# EAGLE design Arduino Mega Extended Breakout Shield (EAGLE 6.2)
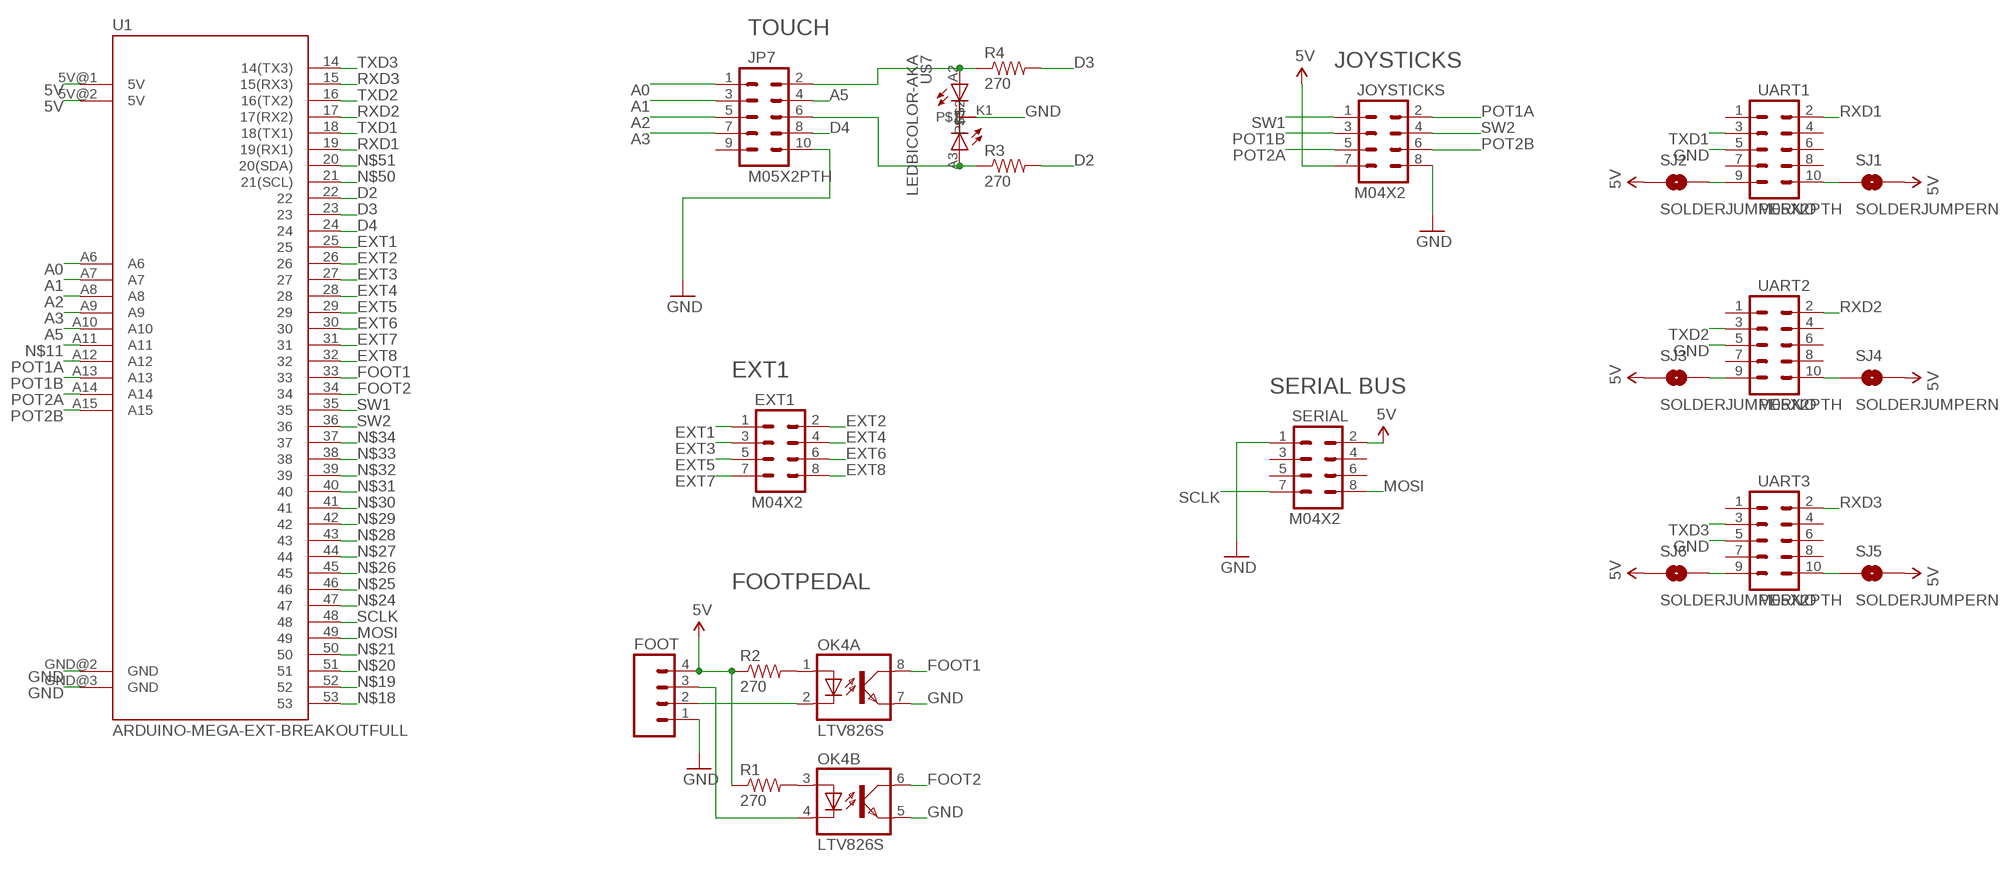
[diagram p0: schematic, sheet 1]

## Parts
EXT1  M04X2  [2X4]
FOOT  M04LOCK  [1X04_LOCK]
JOYSTICKS  M04X2  [2X4]
JP7  M05X2PTH  [AVR_ICSP]
OK4  LTV826S  [DIL8-SMD]
R1  270  RESISTOR0603-RES  [0603-RES]
R2  270  RESISTOR0603-RES  [0603-RES]
R3  270  RESISTOR0603-RES  [0603-RES]
R4  270  RESISTOR0603-RES  [0603-RES]
SERIAL  M04X2  [2X4]
SJ1  SOLDERJUMPERNO  [SJ_2S-NO]
SJ2  SOLDERJUMPERNO  [SJ_2S-NO]
SJ3  SOLDERJUMPERNO  [SJ_2S-NO]
SJ4  SOLDERJUMPERNO  [SJ_2S-NO]
SJ5  SOLDERJUMPERNO  [SJ_2S-NO]
SJ6  SOLDERJUMPERNO  [SJ_2S-NO]
U1  ARDUINO-MEGA-EXT-BREAKOUTFULL  [ARDUINO_MEGA_EXT_BREAKOUT]
U$7  LEDBICOLOR-AKA  [LED5MM-BICOLOR]
UART1  M05X2PTH  [AVR_ICSP]
UART2  M05X2PTH  [AVR_ICSP]
UART3  M05X2PTH  [AVR_ICSP]

## Nets
5V [Power]: FOOT.4 JOYSTICKS.7 R1.1 R2.1 SERIAL.2 SJ1.2 SJ2.1 SJ3.1 SJ4.2 SJ5.2 SJ6.1 U1.5V@1(5V) U1.5V@2(5V)
A0: JP7.1 U1.A6
A1: JP7.3 U1.A7
A2: JP7.5 U1.A8
A3: JP7.7 U1.A9
A5: JP7.4 U1.A10
D2: R3.2 U1.22
D3: R4.2 U1.23
D4: JP7.8 U1.24
EXT1: EXT1.1 U1.25
EXT2: EXT1.2 U1.26
EXT3: EXT1.3 U1.27
EXT4: EXT1.4 U1.28
EXT5: EXT1.5 U1.29
EXT6: EXT1.6 U1.30
EXT7: EXT1.7 U1.31
EXT8: EXT1.8 U1.32
FOOT1: OK4.8(A:COL) U1.33
FOOT2: OK4.6(B:COL) U1.34
GND [Power]: FOOT.1 JOYSTICKS.8 JP7.10 OK4.5(B:EMIT) OK4.7(A:EMIT) SERIAL.1 U1.GND@2(GND) U1.GND@3(GND) U$7.K1 UART1.5 UART2.5 UART3.5
MOSI: SERIAL.8 U1.49
N$1: OK4.3(B:A) R1.2
N$2: OK4.1(A:A) R2.2
N$3: SJ6.2 UART3.9
N$4: FOOT.2 OK4.2(A:C)
N$5: FOOT.3 OK4.4(B:C)
N$6: SJ3.2 UART2.9
N$7: JP7.2 R4.1 U$7.A2
N$8: JP7.6 R3.1 U$7.A3
N$9: SJ2.2 UART1.9
N$10: SJ1.1 UART1.10
N$11: U1.A11
N$12: SJ4.1 UART2.10
N$13: SJ5.1 UART3.10
N$18: U1.53
N$19: U1.52
N$20: U1.51
N$21: U1.50
N$24: U1.47
N$25: U1.46
N$26: U1.45
N$27: U1.44
N$28: U1.43
N$29: U1.42
N$30: U1.41
N$31: U1.40
N$32: U1.39
N$33: U1.38
N$34: U1.37
N$50: U1.21(21(SCL))
N$51: U1.20(20(SDA))
POT1A: JOYSTICKS.2 U1.A12
POT1B: JOYSTICKS.3 U1.A13
POT2A: JOYSTICKS.5 U1.A14
POT2B: JOYSTICKS.6 U1.A15
RXD1: U1.19(19(RX1)) UART1.2
RXD2: U1.17(17(RX2)) UART2.2
RXD3: U1.15(15(RX3)) UART3.2
SCLK: SERIAL.7 U1.48
SW1: JOYSTICKS.1 U1.35
SW2: JOYSTICKS.4 U1.36
TXD1: U1.18(18(TX1)) UART1.3
TXD2: U1.16(16(TX2)) UART2.3
TXD3: U1.14(14(TX3)) UART3.3
Unconnected: JP7.9 SERIAL.3 SERIAL.4 SERIAL.5 SERIAL.6 UART1.1 UART1.4 UART1.6 UART1.7 UART1.8 UART2.1 UART2.4 UART2.6 UART2.7 UART2.8 UART3.1 UART3.4 UART3.6 UART3.7 UART3.8

## Notes on the sheet
- TOUCH
- JOYSTICKS
- EXT1
- SERIAL BUS
- FOOTPEDAL

## Library data of the parts
EXT1 JOYSTICKS SERIAL = SparkFun:M04X2
FOOT = SparkFun:M04: Header 4 Standard 4-pin 0.1" header. Use with straight break away headers (SKU : PRT-00116), right angle break away headers (PRT-00553), swiss pins (PRT-00743), machine pins (PRT-00117), and female headers (PRT-00115). Molex polarized connector foot print use with SKU : PRT-08231 with associated crimp pins and housings. 1MM SMD Version SKU: PRT-10208
JP7 UART1-UART3 = SparkFun:M05X2: Header 5x2 Standard 10-pin dual row 0.1" header. Commonly used with AVR-ISP. Use with Spark Fun Electronics SKU: PRT-00778
OK4 = optocoupler:LTV826: OPTO COUPLER Source: LITEON, LTV816.pdf; OC_FARNELL: unknown; OC_NEWARK: unknown
R1-R4 = SparkFun:RESISTOR: Resistor Basic schematic elements and footprints for 0603, 1206, and PTH resistors.
SJ1-SJ6 = SparkFun:SOLDERJUMPER: Solder Jumper Standard SMD solder jumper. Used to automate production. Two varients : Normally Open and Normally Closed are the same, but have different paste layers. NC will have a large amount of paste and should jumper during reflow.
U1 = SKAARHOJ:ARDUINO-MEGA-EXT-BREAKOUT: Arduino Mega footprint connections
U$7 = SKAARHOJ:LEDBICOLOR-AKA

## Net classes
0 default: width 0.152 mm, drill 0.406 mm, clearance 0.152 mm
1 Power: width 0.406 mm, drill 0.61 mm, clearance 0.254 mm
3 INput lines: clearance 0.203 mm

## Board
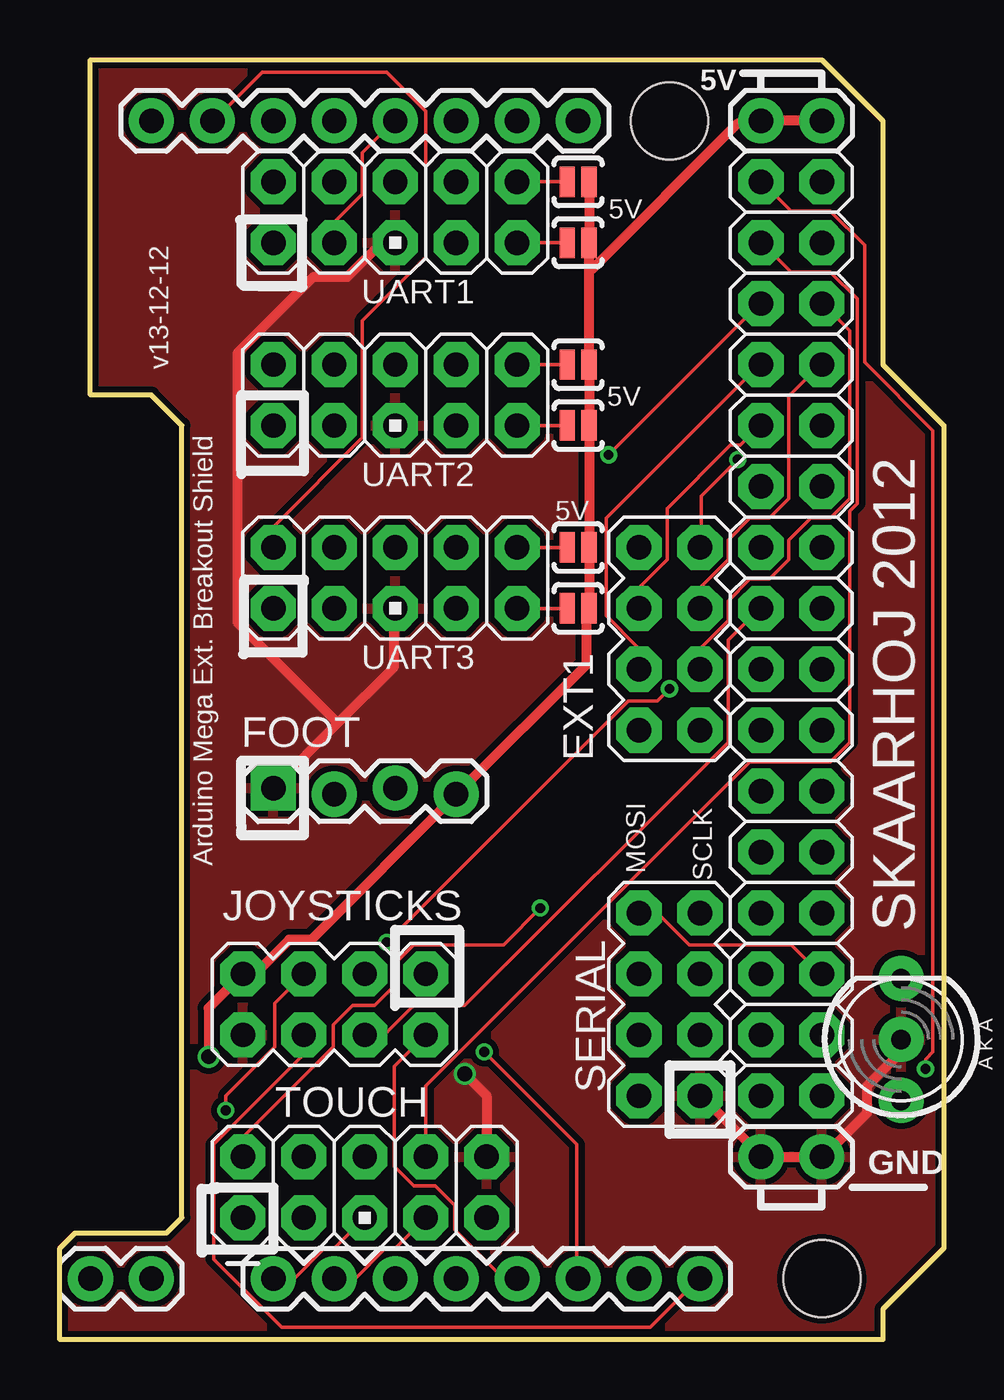
[diagram p1: board, top side]
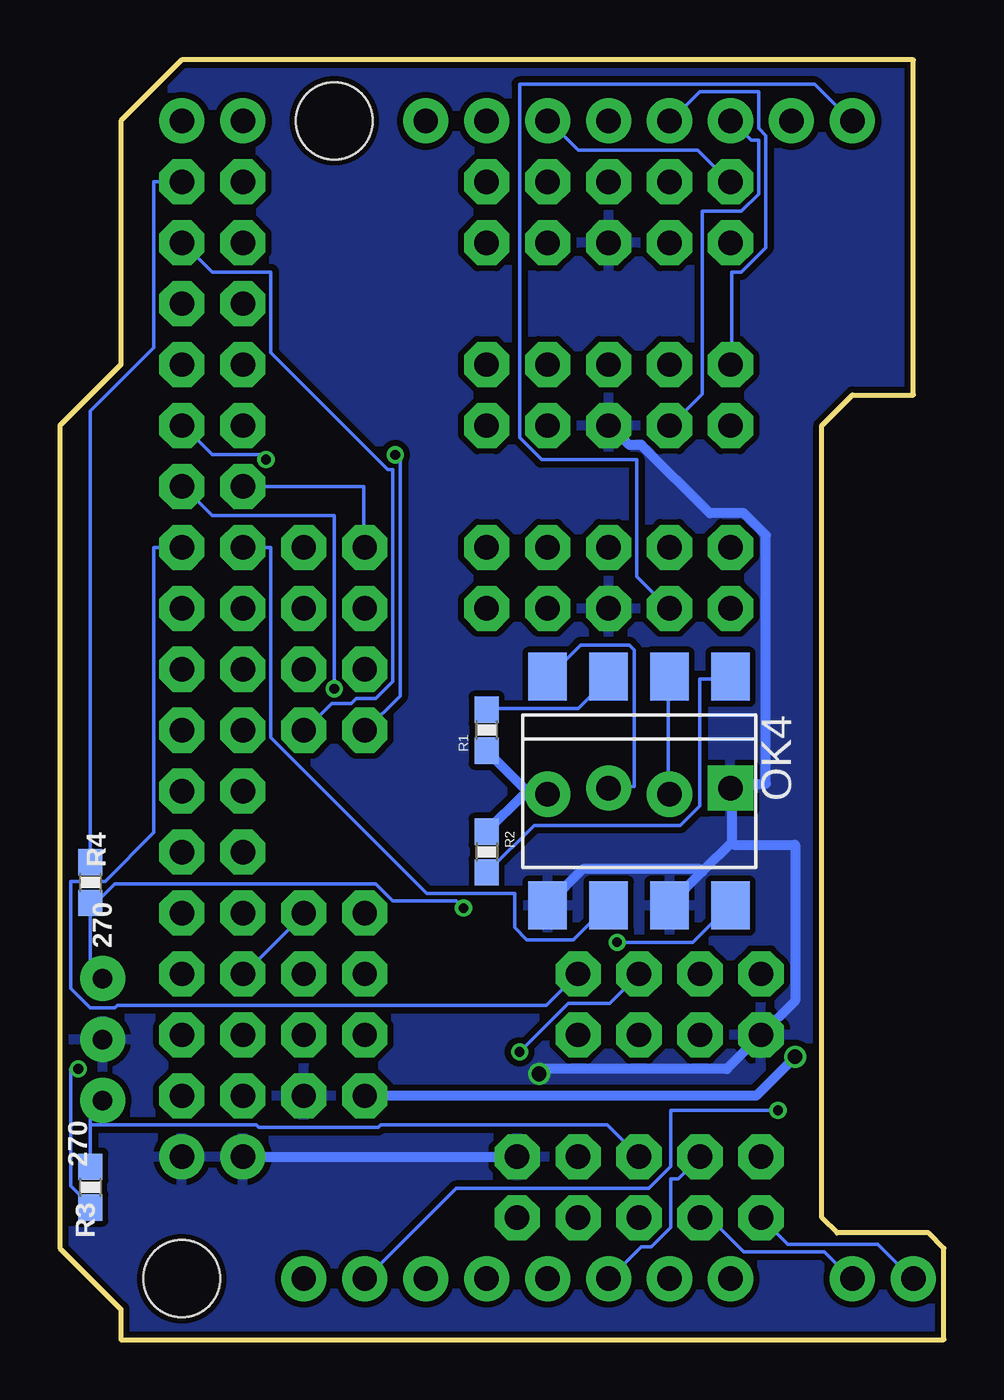
[diagram p2: board, bottom side, seen from below]

Size 36.83 x 53.34 mm. Coordinates in mm from the lower left corner, seen from the top.
Copper layers (1*16): Top 0.035mm / dielectric 1.5mm / Bottom 0.035mm
Design rules: minimum track width 6mil, minimum drill 12mil, track to track 6mil, track to pad 6mil, pad to pad 6mil, via to via 6mil, smd to smd 0mil, copper to edge 10mil, drill to drill 10mil, minimum pad ring 10mil, minimum via ring 6mil, stop-mask expansion 2mil, vias tented up to drill 100mil, thermal gap 10mil

### Footprints (pad centres in the part's own frame; a part is rotated, then mirrored left to right if it is on the bottom)
2X4 = drill 1.016 pad 1.88 octagon: 1 -3.81,-1.27; 2 -3.81,1.27; 3 -1.27,-1.27; 4 -1.27,1.27; 5 1.27,-1.27; 6 1.27,1.27; 7 3.81,-1.27; 8 3.81,1.27
1X04_LOCK = drill 1.016 pad 1.88 square: 1 0,0.127 | drill 1.016 pad 1.88: 2 2.54,-0.127; 3 5.08,0.127; 4 7.62,-0.127
AVR_ICSP = drill 1.016 pad 1.88 octagon: 1 -1.27,5.08; 2 1.27,5.08; 3 -1.27,2.54; 4 1.27,2.54; 5 -1.27,0; 6 1.27,0; 7 -1.27,-2.54; 8 1.27,-2.54; 9 -1.27,-5.08; 10 1.27,-5.08
DIL8-SMD = smd 1.6 x 2: 1 -3.81,-4.77; 2 -1.27,-4.77; 3 1.27,-4.77; 4 3.81,-4.77; 5 3.81,4.77; 6 1.27,4.77; 7 -1.27,4.77; 8 -3.81,4.77
0603-RES = smd 1.1 x 1: 1 -0.85,0; 2 0.85,0
SJ_2S-NO = smd 0.635 x 1.27: 1 -0.45,0; 2 0.45,0
ARDUINO_MEGA_EXT_BREAKOUT = drill 1.016 pad 1.88: 5V@1 29.21,50.8; 5V@2 31.75,50.8; 14 3.81,50.8; 15 6.35,50.8; 16 8.89,50.8; 17 11.43,50.8; 18 13.97,50.8; 19 16.51,50.8; 20 19.05,50.8; 21 21.59,50.8; A6 1.27,2.54; A7 3.81,2.54; A8 8.89,2.54; A9 11.43,2.54; A10 13.97,2.54; A11 16.51,2.54; A12 19.05,2.54; A13 21.59,2.54; A14 24.13,2.54; A15 26.67,2.54; GND@2 29.21,7.62; GND@3 31.75,7.62 | drill 1.016 pad 1.88 octagon: 22 29.21,48.26; 23 31.75,48.26; 24 29.21,45.72; 25 31.75,45.72; 26 29.21,43.18; 27 31.75,43.18; 28 29.21,40.64; 29 31.75,40.64; 30 29.21,38.1; 31 31.75,38.1; 32 29.21,35.56; 33 31.75,35.56; 34 29.21,33.02; 35 31.75,33.02; 36 29.21,30.48; 37 31.75,30.48; 38 29.21,27.94; 39 31.75,27.94; 40 29.21,25.4; 41 31.75,25.4; 42 29.21,22.86; 43 31.75,22.86; 44 29.21,20.32; 45 31.75,20.32; 46 29.21,17.78; 47 31.75,17.78; 48 29.21,15.24; 49 31.75,15.24; 50 29.21,12.7; 51 31.75,12.7; 52 29.21,10.16; 53 31.75,10.16 | hole 3.2: 25.4,50.8; 31.75,2.54
LED5MM-BICOLOR = drill 0.813 pad 1.88: A2 2.54,0; A3 -2.54,0; K1 0,0

### Placement (x,y rotation side)
EXT1  25.4,29.21 90 top
FOOT  8.89,22.86 0 top
JOYSTICKS  11.43,13.97 180 top
JP7  12.7,6.35 90 top
OK4  12.7,22.86 180 bottom
R1  19.05,25.4 90 bottom
R2  19.05,20.32 270 bottom
R3  35.56,6.35 270 bottom
R4  35.56,19.05 90 bottom
SERIAL  25.4,13.97 90 top
SJ1  21.59,48.26 0 top
SJ2  21.59,45.72 180 top
SJ3  21.59,38.1 180 top
SJ4  21.59,40.64 0 top
SJ5  21.59,33.02 0 top
SJ6  21.59,30.48 180 top
U1  0,0 0 top
U$7  35.05,12.51 90 top
UART1  13.97,46.99 90 top
UART2  13.97,39.37 90 top
UART3  13.97,31.75 90 top

### Tracks (layer width: path | path; a pad name or v marks a point on that pad's centre or on a via)
5V  (via drill 0.61)
  Top 0.406: U1.5V@2 U1.5V@1 29.06,50.7 28.25,50.7 22.15,44.6 22.05,44.6 | SJ1.2 SJ2.1 22.05,45.62 22.05,44.6 | 22.05,44.6 22.05,40.74 SJ4.2 SJ3.1 22.05,38 22.05,33.12 SJ5.2 SJ6.1 21.95,30.38 21.95,28.14 16.66,22.86 FOOT.4 16.46,22.66 10.46,16.66 9.55,16.66 8.13,15.24 JOYSTICKS.7 6.2,13.82 v6.2,11.79
  Bottom 0.406: R2.1 19,21.23 17.58,22.66 16.56,22.66 FOOT.4 17.27,22.76 19,24.49 R1.1 | SERIAL.2 7.82,10.16 v6.2,11.79
A0
  Bottom 0.152: JP7.1 6.5,3.96 2.74,3.96 1.32,2.54 U1.A6
A1
  Bottom 0.152: JP7.3 9.75,5.08 8.33,3.66 4.98,3.66 3.86,2.54 U1.A7
A2
  Top 0.152: U1.A8 9.75,2.54 10.97,3.76 11.38,3.76 JP7.5
A3
  Top 0.152: U1.A9 12.29,2.54 13.51,3.76 13.92,3.76 JP7.7
A5
  Bottom 0.152: JP7.4 11.07,6.71 11.38,6.71 11.38,4.67 12.19,3.86 12.6,3.86 13.92,2.54 U1.A10
D2  (via drill 0.41)
  Top 0.152: v36.07,11.28 36.07,11.68 36.37,11.99 36.37,37.9 33.53,40.74 33.53,45.62 32.11,47.04 30.48,47.04 29.26,48.26 U1.22
  Bottom 0.152: v36.07,11.28 36.37,11.28 36.37,6.4 35.56,5.59 R3.2
D3
  Bottom 0.152: R4.2 35.56,38.71 32.92,41.35 32.92,48.26 U1.23
D4
  Top 0.152: JP7.8 15.24,10.57 28.75,24.08 32.11,24.08 32.92,24.89 32.92,34.54 33.22,34.85 33.22,43.38 32.11,44.5 30.48,44.5 29.26,45.72 U1.24
EXT1
  Bottom 0.152: EXT1.1 26.62,25.4 25.5,26.52 24.69,26.52 24.49,26.72 23.67,26.72 22.96,27.43 22.96,36.27 23.16,36.27 28.04,41.15 28.04,44.5 30.48,44.5 31.7,45.72 U1.25
EXT2  (via drill 0.41)
  Top 0.152: v22.86,36.88 29.16,43.18 U1.26
  Bottom 0.152: v22.86,36.88 22.66,36.88 22.66,26.82 24.08,25.4 EXT1.2
EXT3
  Top 0.152: EXT1.3 26.72,27.94 26.72,28.85 27.84,29.97 27.84,30.79 28.75,31.7 29.57,31.7 30.38,32.51 30.38,33.33 31.29,34.24 32.11,34.24 32.92,35.05 32.92,42.06 31.8,43.18 U1.27
EXT4
  Top 0.152: EXT1.4 24.08,27.94 24.08,28.85 22.76,30.18 22.76,34.24 29.16,40.64 U1.28
EXT5
  Top 0.152: EXT1.5 26.72,30.48 26.72,31.39 27.84,32.51 27.84,33.33 28.75,34.24 29.57,34.24 30.38,35.05 30.38,39.32 31.7,40.64 U1.29
EXT6
  Top 0.152: EXT1.6 24.18,30.48 24.18,31.39 25.3,32.51 25.3,34.65 27.94,37.29 28.35,37.29 29.16,38.1 U1.30
EXT7  (via drill 0.41)
  Top 0.152: v28.25,36.68 26.72,35.15 26.72,33.02 EXT1.7
  Bottom 0.152: v28.25,36.68 28.45,36.88 30.48,36.88 31.7,38.1 U1.31
EXT8
  Bottom 0.152: U1.32 24.18,35.56 24.18,33.02 EXT1.8
FOOT1  (via drill 0.41)
  Top 0.152: v13.61,16.56 23.67,26.62 24.89,26.62 v25.4,27.13
  Bottom 0.152: v13.61,16.56 10.46,16.56 8.94,18.09 OK4.8 | v25.4,27.13 25.4,34.34 30.48,34.34 31.7,35.56 U1.33
FOOT2
  Bottom 0.152: U1.34 28.04,33.02 28.04,25.09 21.54,18.59 17.88,18.59 17.88,17.17 17.37,16.66 15.44,16.66 14.02,18.09 OK4.6
GND  (via drill 0.61)
  Top 0.406: SERIAL.1 26.72,10.16 29.26,7.62 U1.GND@2 U1.GND@3 31.9,7.72 33.63,9.45 33.63,10.57 35.05,11.99 U$7.K1 | 11.58,25.7 8.94,23.06 FOOT.1 | 11.58,25.7 13.92,28.04 13.92,30.48 UART3.5 | UART1.5 13.41,45.72 11.99,44.3 10.57,44.3 7.42,41.15 7.42,29.87 11.58,25.7 | JP7.10 17.78,10.16 v16.87,11.07
  Bottom 0.406: U1.GND@2 JP7.10 | 8.84,20.73 10.06,19.51 | 10.06,19.51 11.38,18.19 OK4.7 | 8.84,20.73 8.84,22.96 FOOT.1 8.84,23.16 7.42,23.16 7.42,33.53 8.33,34.44 9.75,34.44 12.6,37.29 13.11,37.29 13.92,38.1 UART2.5 | OK4.5 16.46,18.19 15.04,19.61 10.16,19.61 10.06,19.51 | 8.84,20.73 8.74,20.62 6.2,20.62 6.2,14.12 JOYSTICKS.8 9.04,11.28 16.66,11.28 v16.87,11.07
  pour Bottom: 0,0 0,53.34 36.83,53.34 36.83,0
  pour Top: 0,0 0,53.34 36.83,53.34 36.83,0
MOSI
  Top 0.152: SERIAL.8 24.89,17.78 26.21,16.46 30.48,16.46 31.7,15.24 U1.49
N$1
  Bottom 0.152: R1.2 19,26.31 15.24,26.31 14.02,27.53 OK4.3
N$2
  Bottom 0.152: R2.2 19,19.51 17.07,21.44 10.97,21.44 10.16,22.25 10.16,27.53 8.94,27.53 OK4.1
N$3
  Top 0.152: UART3.9 SJ6.2
N$4
  Bottom 0.152: OK4.2 11.48,27.53 11.48,22.76 FOOT.2
N$5
  Bottom 0.152: OK4.4 16.46,27.64 15.14,28.96 13.11,28.96 12.9,28.75 12.9,23.06 13.92,23.06 FOOT.3
N$6
  Top 0.152: UART2.9 SJ3.2
N$7  (via drill 0.41)
  Top 0.152: JP7.2 7.62,8.43 11.38,12.19 11.38,13.11 12.19,13.92 13.11,13.92 13.92,14.73 13.92,15.65 14.73,16.46 18.49,16.46 v20.02,17.98
  Bottom 0.152: U$7.A2 35.05,15.14 35.56,15.14 R4.1 35.56,18.29 35.26,18.29 34.54,19 23.67,19 22.96,18.29 20.32,18.29 v20.02,17.98
N$8
  Bottom 0.152: 35.56,8.94 35.56,9.96 35.05,9.96 U$7.A3 | 35.56,8.94 R3.1 | JP7.6 14.02,8.94 23.47,8.94 23.57,8.84 28.55,8.84 28.65,8.94 35.56,8.94
N$9
  Top 0.152: UART1.9 SJ2.2
N$10
  Top 0.152: UART1.10 SJ1.1
N$12
  Top 0.152: UART2.10 SJ4.1
N$13
  Top 0.152: UART3.10 SJ5.1
POT1A
  Top 0.152: U1.A12 18.49,2.54 16.46,4.57 16.46,5.59 15.65,6.4 14.73,6.4 13.92,7.21 13.92,11.38 JOYSTICKS.2
POT1B  (via drill 0.41)
  Top 0.152: v17.68,11.99 21.54,8.13 21.54,2.54 U1.A13
  Bottom 0.152: v17.68,11.99 15.65,14.02 13.92,14.02 JOYSTICKS.3
POT2A  (via drill 0.41)
  Top 0.152: v6.91,9.55 6.91,10.16 8.94,12.19 8.94,14.02 JOYSTICKS.5
  Bottom 0.152: v6.91,9.55 11.38,9.55 11.38,7.21 12.29,6.3 20.32,6.3 24.08,2.54 U1.A14
POT2B
  Top 0.152: JOYSTICKS.6 10.16,11.89 6.4,8.13 6.4,3.35 9.25,0.51 24.59,0.51 26.62,2.54 U1.A15
RXD1
  Bottom 0.152: UART1.2 8.94,48.26 10.26,49.58 15.24,49.58 16.46,50.8 U1.19
RXD2
  Bottom 0.152: UART2.2 8.84,40.64 8.84,44.5 8.43,44.5 7.42,45.52 7.42,50.19 7.72,50.49 7.72,52.02 10.16,52.02 11.38,50.8 U1.17
RXD3
  Top 0.152: UART3.2 8.94,33.02 8.94,33.93 12.6,37.59 12.6,42.47 15.24,45.11 15.24,51.21 13.61,52.83 8.43,52.83 6.4,50.8 U1.15
SCLK
  Bottom 0.152: U1.48 29.16,15.24 26.62,17.78 SERIAL.7
SW1
  Bottom 0.152: JOYSTICKS.1 16.56,13.92 34.44,13.92 34.54,13.82 35.56,13.82 36.37,14.63 36.37,19.1 34.95,19.1 32.92,21.13 32.92,33.02 U1.35
SW2
  Top 0.152: JOYSTICKS.4 13.51,12.7 14.73,13.92 16.87,13.92 27.84,24.89 27.84,29.16 29.16,30.48 U1.36
TXD1
  Top 0.152: UART1.3 11.48,45.72 11.48,46.63 12.6,47.75 12.6,49.48 13.92,50.8 U1.18
TXD2
  Bottom 0.152: UART2.3 11.38,38.1 10.06,39.42 10.06,47.04 8.43,47.04 7.72,47.75 7.72,49.99 8.03,49.99 8.84,50.8 U1.16
TXD3
  Bottom 0.152: UART3.3 11.48,30.48 12.8,31.8 12.8,36.68 16.76,36.68 17.68,37.59 17.68,52.32 5.38,52.32 3.86,50.8 U1.14

### Text on the board
_tsilk: 5V | v13-12-12 | 5V | 5V | SCLK | Arduino Mega Ext. Breakout Shield | MOSI | SKAARHOJ 2012 | TOUCH
_bsilk: GND | GND | Vin | 5V